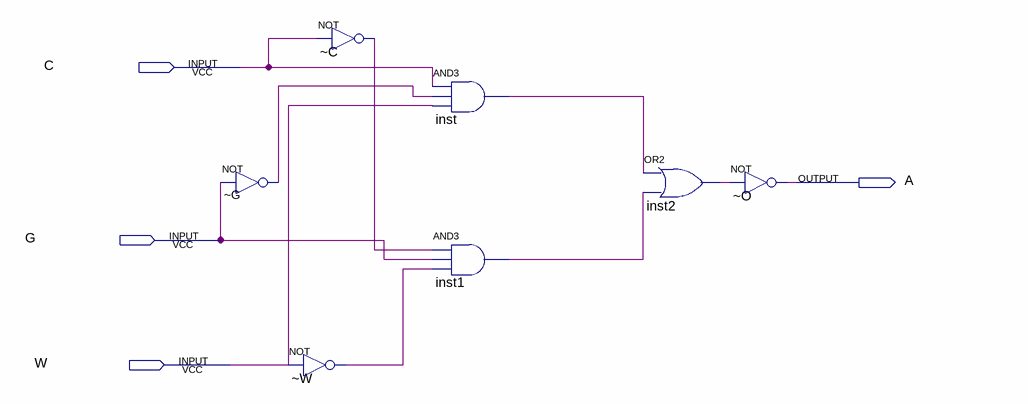
[diagram p0: schematic sheet]
// Quartus schematic lab2step2.bdf as structural Verilog: 7 symbols, 4 pins
module lab2step2 (
  input  C,
  input  G,
  input  W,
  output A
);

  wire _C_out, _G_out, _W_out, inst1_out, inst2_out, inst_out;

  not \u_~G  (_G_out, G);
  not \u_~C  (_C_out, C);
  not \u_~W  (_W_out, W);
  and inst (inst_out, C, _G_out, W);
  and inst1 (inst1_out, _C_out, G, _W_out);
  or inst2 (inst2_out, inst_out, inst1_out);
  not \u_~O  (A, inst2_out);
endmodule
